# EAGLE design fpga_programmer_r2 (EAGLE 5.11)
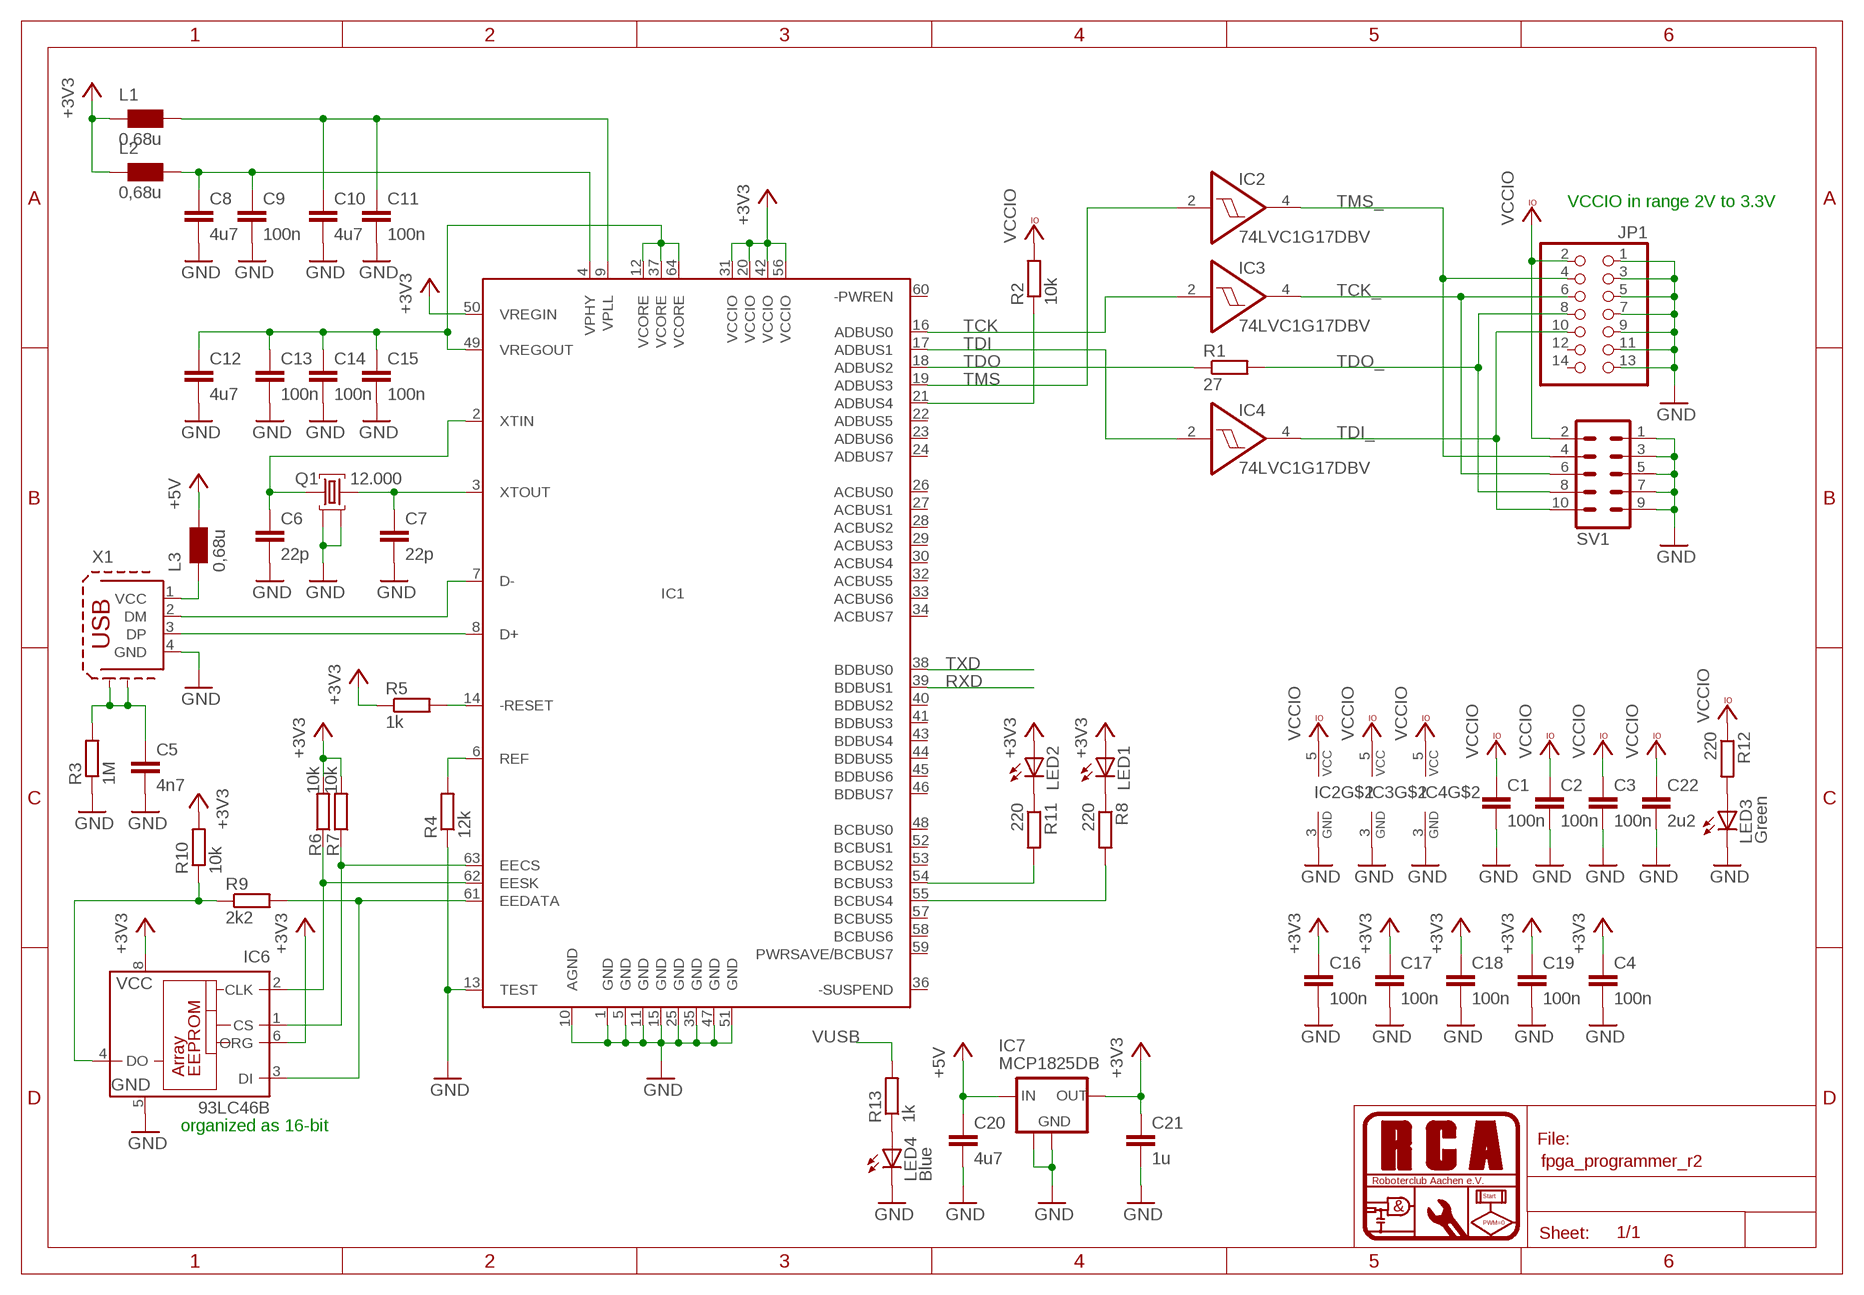
[diagram p0: schematic, sheet 1]

## Parts
C1  100n  C-EUC0805  [C0805]
C2  100n  C-EUC0805  [C0805]
C3  100n  C-EUC0805  [C0805]
C4  100n  C-EUC0805  [C0805]
C5  4n7  C-EUC0805  [C0805]
C6  22p  C-EUC0805  [C0805]
C7  22p  C-EUC0805  [C0805]
C8  4u7  C-EUC0805  [C0805]
C9  100n  C-EUC0805  [C0805]
C10  4u7  C-EUC0805  [C0805]
C11  100n  C-EUC0805  [C0805]
C12  4u7  C-EUC0805  [C0805]
C13  100n  C-EUC0805  [C0805]
C14  100n  C-EUC0805  [C0805]
C15  100n  C-EUC0805  [C0805]
C16  100n  C-EUC0805  [C0805]
C17  100n  C-EUC0805  [C0805]
C18  100n  C-EUC0805  [C0805]
C19  100n  C-EUC0805  [C0805]
C20  4u7  C-EUC0805  [C0805]
C21  1u  C-EUC0805  [C0805]
C22  2u2  C-EUC0805  [C0805]
IC1  FT2232HL  [TQFP64-10X10]
IC2  74LVC1G17DBV  [SOT23-5]
IC3  74LVC1G17DBV  [SOT23-5]
IC4  74LVC1G17DBV  [SOT23-5]
IC6  93LC46B  93LC46SN  [SO-08]
IC7  MCP1825DB  [SOT223]
JP1  PINHD-2X7_2.00  [2X07M]
L1  0,68u  WE-CBF_0805  [0805]
L2  0,68u  WE-CBF_0805  [0805]
L3  0,68u  WE-CBF_0805  [0805]
LED1  LEDCHIPLED_0805  [CHIPLED_0805]
LED2  LEDCHIPLED_0805  [CHIPLED_0805]
LED3  Green  LEDCHIPLED_0805  [CHIPLED_0805]
LED4  Blue  LEDCHIPLED_0805  [CHIPLED_0805]
Q1  12.000  MQ  [MQ]
R1  27  R-EU_M0805  [M0805]
R2  10k  R-EU_M0805  [M0805]
R3  1M  R-EU_M0805  [M0805]
R4  12k  R-EU_M0805  [M0805]
R5  1k  R-EU_M0805  [M0805]
R6  10k  R-EU_M0805  [M0805]
R7  10k  R-EU_M0805  [M0805]
R8  220  R-EU_M0805  [M0805]
R9  2k2  R-EU_M0805  [M0805]
R10  10k  R-EU_M0805  [M0805]
R11  220  R-EU_M0805  [M0805]
R12  220  R-EU_M0805  [M0805]
R13  1k  R-EU_M0805  [M0805]
SV1  ML10  [ML10]
X1  USB  [USB-B]

## Nets
1V8: C12.1 C13.1 C14.1 C15.1 IC1.12(VCORE) IC1.37(VCORE) IC1.49(VREGOUT) IC1.64(VCORE)
+3V3: C4.1 C16.1 C17.1 C18.1 C19.1 C21.1 IC1.20(VCCIO) IC1.31(VCCIO) IC1.42(VCCIO) IC1.50(VREGIN) IC1.56(VCCIO) IC6.6(ORG) IC6.8(VCC) IC7.3(OUT) L1.1 L2.1 LED1.A LED2.A R5.1 R6.2 R7.2 R10.2
+5V: C20.1 IC7.1(IN) L3.2
GND: C1.2 C2.2 C3.2 C4.2 C5.2 C6.2 C7.2 C8.2 C9.2 C10.2 C11.2 C12.2 C13.2 C14.2 C15.2 C16.2 C17.2 C18.2 C19.2 C20.2 C21.2 C22.2 IC1.1(GND) IC1.5(GND) IC1.10(AGND) IC1.11(GND) IC1.13(TEST) IC1.15(GND) IC1.25(GND) IC1.35(GND) IC1.47(GND) IC1.51(GND) IC2.3(GND) IC3.3(GND) IC4.3(GND) IC6.5(GND) IC7.2(GND) IC7.4(GND) JP1.1 JP1.3 JP1.5 JP1.7 JP1.9 JP1.11 JP1.13 LED3.C LED4.C Q1.2(GND) Q1.4(GND) R3.1 R4.1 SV1.1 SV1.3 SV1.5 SV1.7 SV1.9 X1.4(GND)
N$1: IC1.21(ADBUS4) R2.1
N$2: IC6.4(DO) R9.1 R10.1
N$7: LED3.A R12.2
N$8: IC1.7(D-) X1.2(DM)
N$9: IC1.8(D+) X1.3(DP)
N$10: IC1.63(EECS) IC6.1(CS) R7.1
N$11: C5.1 R3.2 X1.5 X1.6
N$12: IC1.62(EESK) IC6.2(CLK) R6.1
N$13: IC1.61(EEDATA) IC6.3(DI) R9.2
N$14: C7.1 IC1.3(XTOUT) Q1.3
N$15: C6.1 IC1.2(XTIN) Q1.1
N$16: IC1.54(BCBUS3) R11.2
N$17: IC1.6(REF) R4.2
N$18: IC1.14(-RESET) R5.2
N$19: IC1.55(BCBUS4) R8.2
N$20: LED1.C R8.1
N$21: LED2.C R11.1
N$22: LED4.A R13.1
N$25: C8.1 C9.1 IC1.4(VPHY) L2.2
N$26: C10.1 C11.1 IC1.9(VPLL) L1.2
RXD: IC1.39(BDBUS1)
TCK: IC1.16(ADBUS0) IC3.2(I)
TCK_: IC3.4(O) JP1.6 SV1.6
TDI: IC1.17(ADBUS1) IC4.2(I)
TDI_: IC4.4(O) JP1.10 SV1.10
TDO: IC1.18(ADBUS2) R1.1
TDO_: JP1.8 R1.2 SV1.8
TMS: IC1.19(ADBUS3) IC2.2(I)
TMS_: IC2.4(O) JP1.4 SV1.4
TXD: IC1.38(BDBUS0)
VCCIO: C1.1 C2.1 C3.1 C22.1 IC2.5(VCC) IC3.5(VCC) IC4.5(VCC) JP1.2 R2.2 R12.1 SV1.2
VUSB: L3.1 R13.2 X1.1(VCC)
Unconnected: IC1.22(ADBUS5) IC1.23(ADBUS6) IC1.24(ADBUS7) IC1.26(ACBUS0) IC1.27(ACBUS1) IC1.28(ACBUS2) IC1.29(ACBUS3) IC1.30(ACBUS4) IC1.32(ACBUS5) IC1.33(ACBUS6) IC1.34(ACBUS7) IC1.36(-SUSPEND) IC1.40(BDBUS2) IC1.41(BDBUS3) IC1.43(BDBUS4) IC1.44(BDBUS5) IC1.45(BDBUS6) IC1.46(BDBUS7) IC1.48(BCBUS0) IC1.52(BCBUS1) IC1.53(BCBUS2) IC1.57(BCBUS5) IC1.58(BCBUS6) IC1.59(PWRSAVE/BCBUS7) IC1.60(-PWREN) IC6.7(NU) JP1.12 JP1.14

## Notes on the sheet
- VCCIO in range 2V to 3.3V
- organized as 16-bit

## Library data of the parts
C1-C22 = rcl:C-EU: CAPACITOR, European symbol
IC1 = ftdichip-3:FT2232H: FT2232H USB2.0 High speed dual Serial/FIFO controller 64 pin device
IC2-IC4 = 74xx-little-de:74*1G17: Single Schmitt-Trigger Buffer
IC6 = microchip:93*: Serial EPROM 1 K/2 K/4 K, low voltage, Microwire
IC7 = rca_spgversorgung:MCP182*
JP1 = pinhead2:PINHD-2X7: PIN HEADER
L1-L3 = wuerth-elektronik:WE-CBF: SMD EMI Suppression Ferrite Beads - excellent anti-EMI properties - low DCR - impedances till 3000 ohms - rated current up to 6 A
LED1-LED4 = led:LED: LED OSRAM: - CHIPLED LG R971, LG N971, LY N971, LG Q971, LY Q971, LO R971, LY R971 LH N974, LH R974 LS Q976, LO Q976, LY Q976 LO Q996 - Hyper CHIPLED LW Q18S LB Q993, LB Q99A, LB R99A - SideLED LS A670, LO A670, LY A670, LG A670, LP A670 LB A673, LV A673, LT A673, LW A673 LH A674 LY A675 LS A676, LA A676, LO A676, LY A676, LW A676 LS A679, LY A679, LG A679 - Hyper Micro SIDELED® LS Y876, LA Y876, LO Y876, LY Y876 LT Y87S - SmartLED LW L88C, LW L88S LB L89C, LB L89S, LG L890 LS L89K, LO L89K, LY L89K LS L896, LA L896, LO L896, LY L896 - TOPLED LS T670, LO T670, LY T670, LG T670, LP T670 LSG T670, LSP T670, LSY T670, LOP T670, LYG T670 LG T671, LOG T671, LSG T671 LB T673, LV T673, LT T673, LW T673 LH T674 LS T676, LA T676, LO T676, LY T676, LB T676, LH T676, LSB T676, LW T676 LB T67C, LV T67C, LT T67C, LS T67K, LO T67K, LY T67K, LW E67C LS E67B, LA E67B, LO E67B, LY E67B, LB E67C, LV E67C, LT E67C LW T67C LS T679, LY T679, LG T679 LS T770, LO T770, LY T770, LG T770, LP T770 LB T773, LV T773, LT T773, LW T773 LH T774 LS E675, LA E675, LY E675, LS T675 LS T776, LA T776, LO T776, LY T776, LB T776 LHGB T686 LT T68C, LB T68C - Hyper Mini TOPLED® LB M676 - Mini TOPLED Santana® LG M470 LS M47K, LO M47K, LY M47K Source: http://www.osram.convergy.de LUXEON: - LUMILED® LXK2-PW12-R00, LXK2-PW12-S00, LXK2-PW14-U00, LXK2-PW14-V00 LXK2-PM12-R00, LXK2-PM12-S00, LXK2-PM14-U00 LXK2-PE12-Q00, LXK2-PE12-R00, LXK2-PE12-S00, LXK2-PE14-T00, LXK2-PE14-U00 LXK2-PB12-K00, LXK2-PB12-L00, LXK2-PB12-M00, LXK2-PB14-N00, LXK2-PB14-P00, LXK2-PB14-Q00 LXK2-PR12-L00, LXK2-PR12-M00, LXK2-PR14-Q00, LXK2-PR14-R00 LXK2-PD12-Q00, LXK2-PD12-R00, LXK2-PD12-S00 LXK2-PH12-R00, LXK2-PH12-S00 LXK2-PL12-P00, LXK2-PL12-Q00, LXK2-PL12-R00 Source: www.luxeon.com KINGBRIGHT: KA-3528ASYC Source: www.kingbright.com
Q1 = rca_sontiges:MQ: MT Crystals from Euroquartz UNTESTED Ultra-miniature (5.0mm x 7.0mm) AT-cut crystals covering the frequency range 6.0 MHz to 45.0MHz in fundamental mode and 30.0 MHz to 125.0 MHz in 3rd octave mode. Features Euroquartz Datasheet MQ Crystal <http://www.euroquartz.co.uk/Portals/0/mq.pdf> Calibration Tolerance: +/- 30ppm Frequency Stability: +/- 30ppm Load Capacitancy: 12pF typ. Ordering Distributed by Reichelt as "Keramik-SMD-Quarz, 5x7x1,2mm". Reichelt: $(VALUE)-MQ Available Frequncies at Reichelt's 6.000000 MHz 8.000000 MHz 11.059200 MHz 12.000000 MHz 14.318180 MHz 14.745600 MHz 16.000000 MHz 16.384000 MHz 18.432000 MHz 20.000000 MHz 24.000000 MHz 24.576000 MHz 25.000000 MHz Status 2011-11 Added by Sascha, untested.
R1-R13 = rcl:R-EU_: RESISTOR, European symbol
SV1 = con-harting-ml:ML10: HARTING
X1 = rca_stecker:USB: BERG

## Board
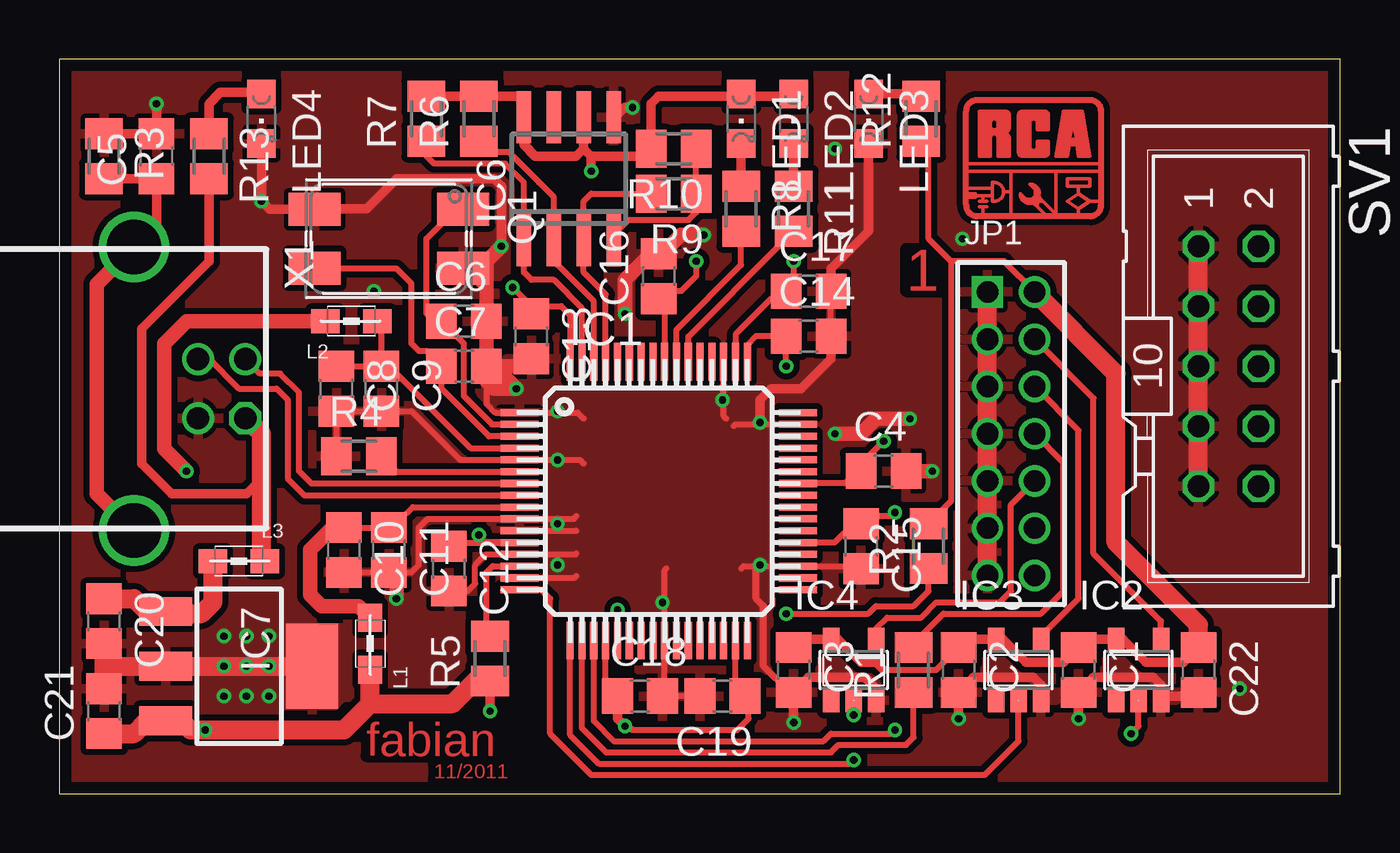
[diagram p1: board, top side]
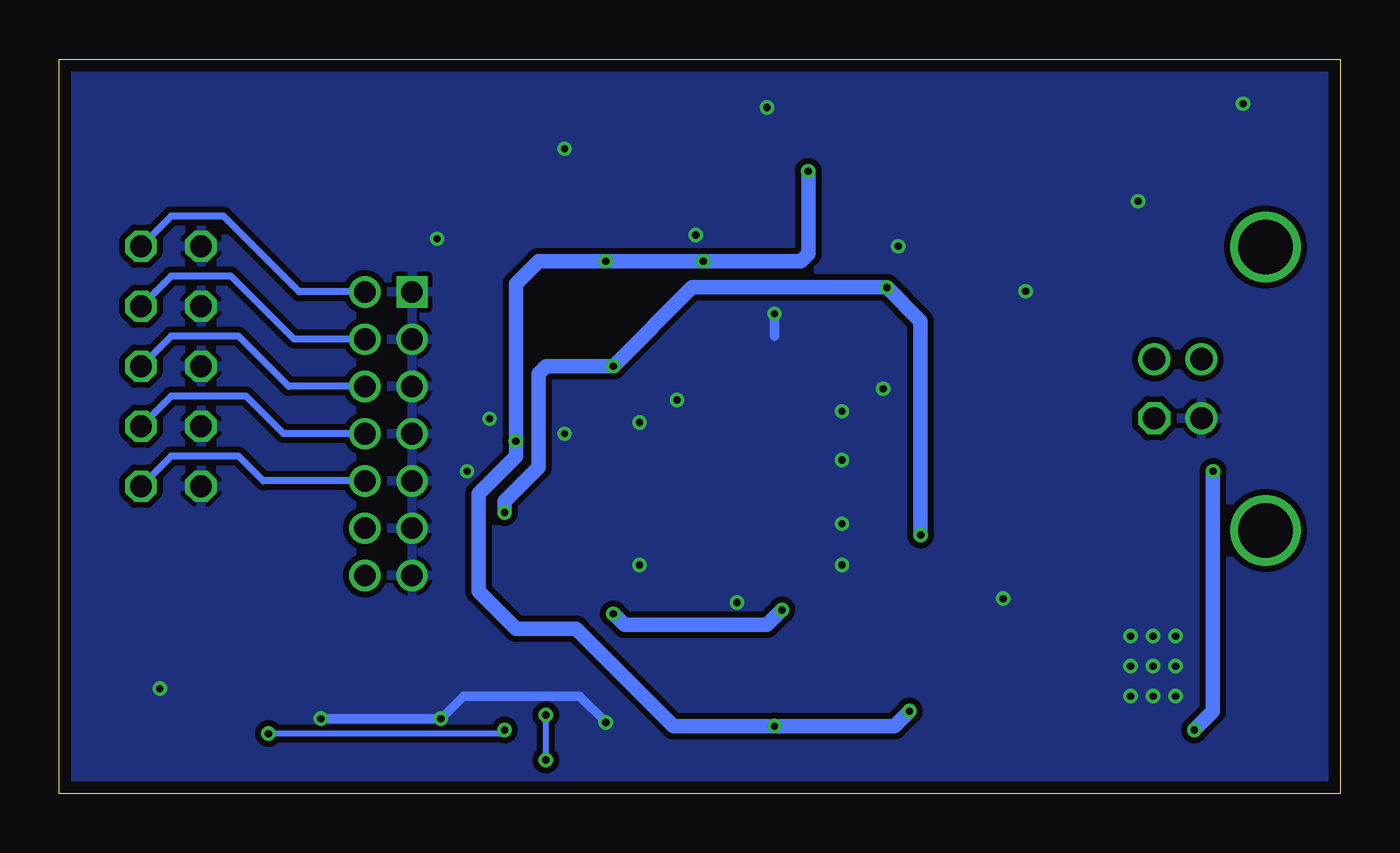
[diagram p2: board, bottom side, seen from below]

Size 54.27 x 31.1 mm. Coordinates in mm from the lower left corner, seen from the top.
Outline: 0,0 54.27,0 54.27,31.1 0,31.1 0,0
Copper layers (1*16): Top 0.035mm / dielectric 1.5mm / Bottom 0.035mm
Design rules "PCB-POOL": minimum track width 6mil, minimum drill 12mil, track to track 6mil, track to pad 6mil, pad to pad 6mil, via to via 6mil, smd to smd 6mil, copper to edge 20mil, drill to drill 8mil, minimum pad ring 8mil, minimum via ring 6mil, stop-mask expansion 3mil, vias tented up to drill 0mil, thermal gap 8mil

### Footprints (pad centres in the part's own frame; a part is rotated, then mirrored left to right if it is on the bottom)
C0805 = smd 1.3 x 1.5: 1 -0.95,0; 2 0.95,0
TQFP64-10X10 = smd 1.6 x 0.3: 1 -5.9,3.75; 2 -5.9,3.25; 3 -5.9,2.75; 4 -5.9,2.25; 5 -5.9,1.75; 6 -5.9,1.25; 7 -5.9,0.75; 8 -5.9,0.25; 9 -5.9,-0.25; 10 -5.9,-0.75; 11 -5.9,-1.25; 12 -5.9,-1.75; 13 -5.9,-2.25; 14 -5.9,-2.75; 15 -5.9,-3.25; 16 -5.9,-3.75; 33 5.9,-3.75; 34 5.9,-3.25; 35 5.9,-2.75; 36 5.9,-2.25; 37 5.9,-1.75; 38 5.9,-1.25; 39 5.9,-0.75; 40 5.9,-0.25; 41 5.9,0.25; 42 5.9,0.75; 43 5.9,1.25; 44 5.9,1.75; 45 5.9,2.25; 46 5.9,2.75; 47 5.9,3.25; 48 5.9,3.75 | smd 0.3 x 1.6: 17 -3.75,-5.9; 18 -3.25,-5.9; 19 -2.75,-5.9; 20 -2.25,-5.9; 21 -1.75,-5.9; 22 -1.25,-5.9; 23 -0.75,-5.9; 24 -0.25,-5.9; 25 0.25,-5.9; 26 0.75,-5.9; 27 1.25,-5.9; 28 1.75,-5.9; 29 2.25,-5.9; 30 2.75,-5.9; 31 3.25,-5.9; 32 3.75,-5.9; 49 3.75,5.9; 50 3.25,5.9; 51 2.75,5.9; 52 2.25,5.9; 53 1.75,5.9; 54 1.25,5.9; 55 0.75,5.9; 56 0.25,5.9; 57 -0.25,5.9; 58 -0.75,5.9; 59 -1.25,5.9; 60 -1.75,5.9; 61 -2.25,5.9; 62 -2.75,5.9; 63 -3.25,5.9; 64 -3.75,5.9
SOT23-5 = smd 0.69 x 0.99: 1 -0.95,-1.29; 2 0,-1.29; 3 0.95,-1.29; 4 0.95,1.3; 5 -0.95,1.3
SO-08 = smd 0.6 x 2.2: 1 -1.905,-2.6; 2 -0.635,-2.6; 3 0.635,-2.6; 4 1.905,-2.6; 5 1.905,2.6; 6 0.635,2.6; 7 -0.635,2.6; 8 -1.905,2.6
SOT223 = smd 1.219 x 2.235: 1 -2.311,-3.099; 2 0,-3.099; 3 2.311,-3.099 | smd 3.6 x 2.2: 4 0,3.099
2X07M = drill 0.914 square: 1 -6,-1 | drill 0.914 round: 2 -6,1; 3 -4,-1; 4 -4,1; 5 -2,-1; 6 -2,1; 7 0,-1; 8 0,1; 9 2,-1; 10 2,1; 11 4,-1; 12 4,1; 13 6,-1; 14 6,1
0805 = smd 1.2 x 1: 1 -1.1,0; 2 1.1,0
CHIPLED_0805 = smd 1.2 x 1.2: A 0,-1.05; C 0,1.05
MQ = smd 2.2 x 1.4: 1 -3.15,-1.25; 2 3.15,-1.25; 3 3.15,1.25; 4 -3.15,1.25
M0805 = smd 1.3 x 1.6: 1 -0.95,0; 2 0.95,0
ML10 = drill 0.914 octagon: 1 -5.08,-1.27; 2 -5.08,1.27; 3 -2.54,-1.27; 4 -2.54,1.27; 5 0,-1.27; 6 0,1.27; 7 2.54,-1.27; 8 2.54,1.27; 9 5.08,-1.27; 10 5.08,1.27
USB-B = drill 0.95 octagon: 1 1.25,4.71 | drill 0.95 round: 2 -1.25,4.71; 3 -1.25,2.71; 4 1.25,2.71 | drill 2.3 pad 3 round: 5 -6,0; 6 6,0

### Placement (x,y rotation side)
C1  43.18,5.24 270 top
C2  38.1,5.24 270 top
C3  31.11,5.24 270 top
C4  34.92,13.65 0 top
C5  4.13,26.99 90 top
C6  17.14,20 0 top
C7  17.14,18.1 0 top
C8  11.75,17.14 270 top
C9  13.65,17.14 270 top
C10  12.06,10.32 270 top
C11  13.97,10.32 270 top
C12  16.51,9.53 270 top
C13  20,19.37 270 top
C14  31.75,19.37 0 top
C15  33.97,10.48 270 top
C16  25.4,21.91 90 top
C17  31.75,21.27 0 top
C18  24.61,4.13 0 top
C19  28.1,4.13 180 top
C20  1.91,7.3 270 top
C21  1.91,3.49 90 top
C22  48.26,5.24 270 top
IC1  25.4,12.38 0 top
IC2  45.72,5.24 0 top
IC3  40.64,5.24 0 top
IC4  33.66,5.24 0 top
IC6  21.59,26.04 0 top
IC7  7.62,5.4 270 top
JP1  40.32,15.24 270 top
L1  13.18,6.35 90 top
L2  12.38,20 0 top
L3  7.62,9.84 180 top
LED1  28.89,28.57 180 top
LED2  31.11,28.57 180 top
LED3  34.29,28.57 180 top
LED4  8.57,28.57 180 top
Q1  13.97,23.5 180 top
R1  36.2,5.24 90 top
R2  36.83,10.48 90 top
R3  1.91,26.99 270 top
R4  12.7,14.29 0 top
R5  18.26,5.71 90 top
R6  17.78,28.57 90 top
R7  15.56,28.57 90 top
R8  28.89,24.77 270 top
R9  26.04,25.4 180 top
R10  26.04,27.3 180 top
R11  31.11,24.77 270 top
R12  36.51,28.57 90 top
R13  6.35,26.99 270 top
SV1  49.53,18.1 270 top
U$1  [LOGO]  41.27,26.99 0 top
X1  3.17,17.14 270 top

### Tracks (layer width: path | path; a pad name or v marks a point on that pad's centre or on a via)
1V8  (via drill 0.3)
  Top 0.254: IC1.12 16.67,10.63 C12.1 | IC1.49 29.15,18.99 29.53,19.37 C14.1 v30.8,18.1 | IC1.64 21.65,20.26 21.27,20.64 20.32,20.64 C13.1 20,20.64 v19.21,21.43 | IC1.37 32.86,10.63 33.5,11.27 C15.1 34.29,11.43 34.61,11.75 35.24,11.75 v35.4,11.91
  Top 0.305: IC1.12 17.78,10.63 17.78,10.64 v17.78,10.95
  Bottom 0.61: v35.4,11.91 35.4,12.38 33.97,13.81 33.97,17.78 33.66,18.1 v30.8,18.1 27.46,21.43 v19.21,21.43 17.78,20 v17.78,10.95
+3V3  (via drill 0.3)
  Top 0.254: 33.86,13.77 33.66,13.49 33.29,13.13 IC1.42 | 33.86,13.77 C4.1 | 25.65,20.71 IC1.56 | IC1.50 28.65,19.44 30.16,20.95 30.48,20.95 C17.1 31.12,21.43 v31.11,22.54 | IC6.8 19.68,29.21 | 25.65,20.71 C16.1 25.71,21.27 26.35,21.27 26.99,21.91 v26.99,22.54 | 25.65,20.71 25.72,20.64 | 33.86,13.77 33.86,13.86 v34.92,14.92 | IC1.20 23.15,4.63 C18.1 | v23.97,2.86 24.13,2.86 24.29,2.7 28.73,2.7 29.21,3.17 29.21,3.97 C19.1 28.65,4.53 IC1.31
  Top 0.406: 22.23,27.3 IC6.6 | 22.54,26.99 22.23,27.3 | 22.54,26.99 24.77,26.99 R10.2 25.08,29.21 25.4,29.53 28.89,29.53 LED1.A 28.99,29.53 31.11,29.53 LED2.A | IC6.8 19.68,27.46 20.16,26.99 21.91,26.99 22.23,27.3 | 19.68,29.21 19.37,29.52 R6.2 R7.2 | v22.54,26.35 22.54,26.99 | C18.1 23.66,3.17 v23.97,2.86 | R5.1 v18.26,3.49 | R5.1
  Top 0.61: 3.72,3.09 IC7.3 | C21.1 | L2.1 5.4,20 4.45,19.05 4.45,14.61 v5.4,13.65
  Top 0.813: 3.72,3.09 3.17,2.54 C21.1 | IC7.3 5.17,3.09 5.56,2.7 v6.19,2.7 12.06,2.7 12.22,2.86 13.18,3.81 | 13.18,3.81 L1.1 | 13.18,3.81 16.67,3.81 17.62,4.76 R5.1
  Bottom 0.61: v22.54,26.35 22.54,22.86 22.86,22.54 v26.99,22.54 v31.11,22.54 33.97,22.54 34.92,21.59 v34.92,14.92 34.92,14.29 36.51,12.7 36.51,8.57 34.92,6.99 32.38,6.99 28.26,2.86 v23.97,2.86 18.89,2.86 v18.26,3.49 | v5.4,13.65 5.4,3.49 v6.19,2.7
+5V
  Top 0.61: 4.61,7.62 IC7.1 4.52,7.7 4.45,7.62 3.81,7.62
  Top 0.813: L3.2 6.52,8.11 6.03,7.62 4.61,7.62 | 3.81,7.62 3.17,8.26 C20.1
GND  (via drill 0.3)
  Top 0.254: C7.2 18.1,16.51 18.48,16.13 IC1.1 21.97,16.13 22.23,15.88 | C6.2 18.1,18.41 C7.2 | 22.23,13.97 22.06,14.13 IC1.5 16.98,14.13 14.92,16.19 C9.2 C8.2 | 21.91,11.75 21.79,11.63 IC1.10 15.6,11.63 15.24,11.27 15.24,9.68 14.92,9.37 14.29,9.37 | IC1.11 21.89,11.13 21.91,11.11 | 21.91,10.16 21.88,10.13 IC1.13 18.07,10.13 17.62,9.68 17.62,8.89 17.3,8.57 C12.2 | IC1.15 21.83,9.13 21.91,9.21 | IC1.51 28.15,15.98 28.26,15.88 | IC1.47 28.65,15.63 28.57,15.56 | 28.89,9.53 29,9.63 IC1.35 33.76,9.63 C15.2 | 25.72,9.53 25.65,9.46 IC1.25 25.65,4.03 C18.2 C19.2 | 14.29,9.37 C11.2 | 14.29,9.37 C10.2 | C17.2 C14.2 | R4.1 C8.2 | C8.2 | C13.2 19.68,18.1 | C6.2 18.09,21.27 Q1.4
  Top 0.305: C7.2 | C6.2 | C3.2 30.95,4.29 29.84,5.4 29.84,7.94 29.53,8.26 29.53,9.53 v29.69,9.68
  Top 0.406: R3.1 C5.2 v4.13,29.21 | IC4.3 34.6,4.45 34.13,4.92 31.75,4.92 C3.2 v31.11,3.02 | IC3.3 41.59,4.61 41.27,4.92 38.73,4.92 C2.2 v38.1,3.17 | v43.18,3.17 C1.2 43.81,4.92 46.35,4.92 46.67,4.61 IC2.3 46.85,4.13 48.26,4.13 C22.2 | 25.08,22.86 C16.2 | LED3.C 34.29,23.81 32.7,22.23 C17.2 | IC6.5 23.55,28.64 23.97,29.05 v24.29,29.05 | Q1.4 17.8,22.25 v18.73,23.18 18.73,25.72 18.41,26.04 14.29,26.04 13.02,24.77 10.84,24.77 Q1.2 8.91,24.75 v8.57,25.08 LED4.C | v29.69,15.72 29.69,16.67 30.16,17.14 31.43,17.14 32.7,18.41 C14.2
  Top 0.61: C7.2 19.68,18.1 | 25.08,22.86 23.97,21.75 v23.97,20.32 | 14.29,9.37 14.29,9.21 v14.29,8.26 | C4.2 v36.99,13.65 | C16.2 25.56,22.86 26.35,23.65 v27.3,23.65 | 18.1,18.41 18.1,22.54 v18.73,23.18 | 18.1,18.41 18.1,17.46 18.41,17.14 v19.37,17.14 18.1,18.41 | v32.86,15.24 33.97,15.24 34.61,15.88 v36.04,15.88
  Top 0.813: IC7.4 IC7.2 1.91,5.4 | 1.91,5.4 C20.2 | C21.2 1.91,5.4 | JP1.13 JP1.11 JP1.9 JP1.7 JP1.5 JP1.3 JP1.1 | SV1.1 SV1.3 SV1.5 SV1.7 SV1.9
  Bottom 0.406: v31.11,3.02 32.23,4.13 37.15,4.13 v38.1,3.17 v43.18,3.17 | 23.97,19.37 v23.97,20.32
  other vias: 21.11,16.19 21.11,14.13 21.11,11.43 21.11,9.68 25.56,8.1 28.1,16.67 8.89,6.67 7.94,6.67 6.99,6.67 6.99,5.4 7.94,5.4 8.89,5.4 8.89,4.13 7.94,4.13 6.99,4.13 13.34,21.27 32.86,27.3 38.26,23.5 50.01,4.45
  pour Top (isolate 0.305): 20.64,8.57 21.59,7.62 29.21,7.62 30.16,8.57 30.16,16.19 29.21,17.14 21.59,17.14 21.59,20.32 21.27,20.64 18.41,20.64 17.46,19.68 17.46,16.83 18.1,16.19 20.64,16.19
  pour Bottom (isolate 0.254): -1.27,32.38 55.88,32.38 55.88,-1.27 -1.27,-1.27
  pour Top (isolate 0.406, no thermals): 12.06,3.49 6.67,3.49 6.35,3.81 6.35,6.67 6.99,7.3 6.99,8.57 7.3,8.89 10.48,8.89 12.38,6.99 12.38,3.81
  pour Top (isolate 0.254): -2.54,33.66 57.15,33.66 57.15,-2.54 -2.54,-2.54
N$1  (via drill 0.3)
  Top 0.254: IC1.21 v23.65,7.78 | v30.8,7.62 34.29,7.62 34.61,7.94 36.2,7.94 36.83,8.57 R2.1
  Bottom 0.61: v23.65,7.78 23.97,7.46 24.29,7.14 30.32,7.14 v30.8,7.62
N$2
  Top 0.254: IC6.4 23.5,23.65 24.13,24.29 26.67,24.29 26.99,24.61 R9.1 R10.1
N$7
  Top 0.406: LED3.A 36.41,29.62 R12.2
N$8
  Top 0.254: IC1.7 10.68,13.13 10.16,13.65 10.16,16.99 9.37,17.78 8.5,17.78 X1.2 7.91,18.41
N$9
  Top 0.254: IC1.8 10.39,12.63 9.68,13.34 9.68,16.67 9.21,17.14 7.61,17.14 6.35,18.41 6.21,18.39 X1.3
N$10
  Top 0.254: IC1.63 22.15,20.55 20.95,21.75 20,21.75 19.68,22.07 IC6.1 19.68,25.88 18.89,26.67 15.88,26.67 15.56,26.99 R7.1
N$11
  Top 0.406: X1.5 3.17,23.18 4.13,24.13 C5.1 R3.2
  Top 0.61: X1.6 3.14,11.14 1.59,12.7 1.59,21.56 X1.5
N$12
  Top 0.254: IC1.62 22.65,20.85 21.11,22.38 | 21.11,22.38 | 21.11,22.38 20.95,22.54 IC6.2 20.95,25.24 20.32,25.88 | R6.1 18.26,27.15 19.05,27.15 20.32,25.88 | 20.32,25.88
N$13
  Top 0.254: IC1.61 23.15,21.14 22.23,22.07 IC6.3 22.23,25.08 22.54,25.4 R9.2
N$14
  Top 0.254: IC1.3 18.2,15.13 16.19,17.14 C7.1 | C7.1 | C7.1 15.56,18.73 15.24,18.73 14.92,19.05 14.92,21.59 14.29,22.23 10.84,22.23 Q1.3
N$15
  Top 0.254: IC1.2 18.34,15.63 17.14,16.83 17.14,19.05 C6.1 15.88,20 15.56,20.32 15.56,23.5 16.51,24.45 16.82,24.45 Q1.1
N$16
  Top 0.254: IC1.54 26.65,19.35 30.48,23.18 R11.2
N$17
  Top 0.254: IC1.6 14.3,13.63 R4.2
N$18
  Top 0.254: IC1.14 18.36,9.63 18.1,9.37 18.1,6.82 R5.2
N$19
  Top 0.254: IC1.55 26.15,19.64 28.89,22.38 R8.2
N$20
  Top 0.406: R8.1 LED1.C
N$21
  Top 0.406: R11.1 LED2.C
N$22
  Top 0.406: R13.1 6.35,29.21 6.83,29.69 8.51,29.69 LED4.A
N$25
  Top 0.254: IC1.4 17.43,14.63 13.97,18.1 C9.1 | C9.1 | L2.2 13.65,20 C9.1 | C9.1 | C9.1 C8.1
N$26
  Top 0.254: IC1.9 14.99,12.13 14.45,11.59 14.29,11.59 C11.1 C10.1
  Top 0.61: 10.64,8.41 10.64,10.32 11.59,11.27 C10.1 | 10.64,8.41 | 10.64,8.41 11.11,7.94 12.69,7.94 L1.2
TCK
  Top 0.254: IC1.16 20.42,8.63 20.8,8.26 20.8,2.54 22.54,0.79 39.21,0.79 40.64,2.22 IC3.2
TCK_
  Top 0.254: IC3.4 41.59,6.67 43.18,8.26 43.18,15.38 JP1.6
  Bottom 0.305: JP1.6 44.55,17.24 46.67,19.37 49.53,19.37 SV1.6
TDI  (via drill 0.3)
  Top 0.254: IC1.17 21.65,2.48 22.86,1.27 33.5,1.27 v33.66,1.43 | v33.66,3.33 IC4.2
  Bottom 0.254: v33.66,1.43 v33.66,3.33
TDI_
  Top 0.254: IC4.4 34.61,6.99 35.08,7.46 36.51,7.46 37.15,8.1 39.85,8.1 40.32,8.57 40.32,12.24 JP1.10
  Bottom 0.305: JP1.10 45.62,13.24 46.67,14.29 49.53,14.29 SV1.10
TDO
  Top 0.254: IC1.18 22.15,2.77 23.18,1.75 32.7,1.75 33.02,2.06 35.88,2.06 36.2,2.38 R1.1
TDO_
  Top 0.254: R1.2 36.51,6.67 37.47,7.62 41.59,7.62 42.55,8.57 42.55,14.02 JP1.8
  Bottom 0.305: SV1.8 49.53,16.83 46.35,16.83 44.77,15.24 JP1.8
TMS  (via drill 0.3)
  Top 0.254: IC1.19 22.65,3.07 23.5,2.22 32.38,2.22 32.7,2.54 35.24,2.54 v35.4,2.7 | v35.4,2.7 | v45.4,2.54 45.72,2.86 IC2.2
  Bottom 0.254: v35.4,2.7 35.56,2.54 v45.4,2.54
TMS_
  Top 0.254: IC2.4 46.67,7.3 43.81,10.16 43.81,16.75 JP1.4
  Bottom 0.305: JP1.4 44.32,19.24 46.99,21.91 49.53,21.91 SV1.4
VCCIO
  Top 0.254: 34.92,5.24 37.15,5.24 C2.1 | R2.2 37.78,12.38 37.78,22.54 | 37.78,22.54 40.02,22.54 JP1.2 | 37.78,22.54 36.83,23.5 36.83,27.31 R12.1
  Top 0.406: C3.1 31.46,6.54 IC4.5 32.99,6.54 33.97,5.56 34.61,5.56 34.92,5.24 | C2.1 38.45,6.54 IC3.5 39.98,6.54 40.96,5.56 42.55,5.56 C1.1 43.53,6.54 IC2.5 45.05,6.54 46.04,5.56 47.63,5.56 C22.1
  Top 0.813: JP1.2 41.32,21.23 44.77,17.78 44.77,10.64 48.26,7.14 C22.1
  Bottom 0.305: JP1.2 44.1,21.24 47.31,24.45 49.53,24.45 SV1.2
VUSB
  Top 0.406: R13.2 6.35,22.54 3.49,19.68 3.49,13.97 4.76,12.7 7.94,12.7 8.57,13.34
  Top 0.61: 7.92,15.89 X1.1 7.76,15.89 | R13.2
  Top 0.813: 7.92,15.89 8.57,15.24 8.57,13.34 8.57,9.99 L3.1

### Text on the board
Top: 1 | fabian | 11/2011